# EAGLE design kw36_shield (EAGLE 9.5.1)
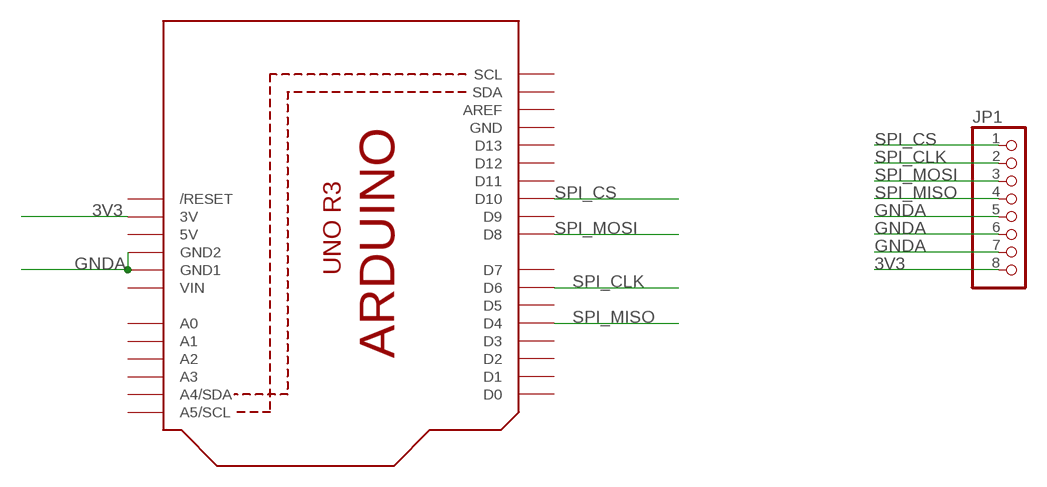
[diagram p0: schematic, sheet 1]

## Parts
JP1  PINHD-1X8  [1X08]
Q1  ARDUINOR3-NOIOREF-NOTEXT  [ARDUINOR3-NOTEXT-NOIOREF]

## Nets
3V3: JP1.8 Q1.3V
GNDA: JP1.5 JP1.6 JP1.7 Q1.GND1 Q1.GND2
SPI_CLK: JP1.2 Q1.D6
SPI_CS: JP1.1 Q1.D10
SPI_MISO: JP1.4 Q1.D4
SPI_MOSI: JP1.3 Q1.D8
Unconnected: Q1.A0 Q1.A1 Q1.A2 Q1.A3 Q1.A4(A4/SDA) Q1.A5(A5/SCL) Q1.AREF Q1.D0 Q1.D1 Q1.D2 Q1.D3 Q1.D5 Q1.D7 Q1.D9 Q1.D11 Q1.D12 Q1.D13 Q1.RESET(/RESET) Q1.SCL Q1.SDA

## Power pins joined to a net without a drawn wire
5V: Q1.5V
GND: Q1.GND
VIN: Q1.VIN

## Library data of the parts
JP1 = pinhead:PINHD-1X8: PIN HEADER
Q1 = adafruit:ARDUINOR3-NOIOREF

## Board
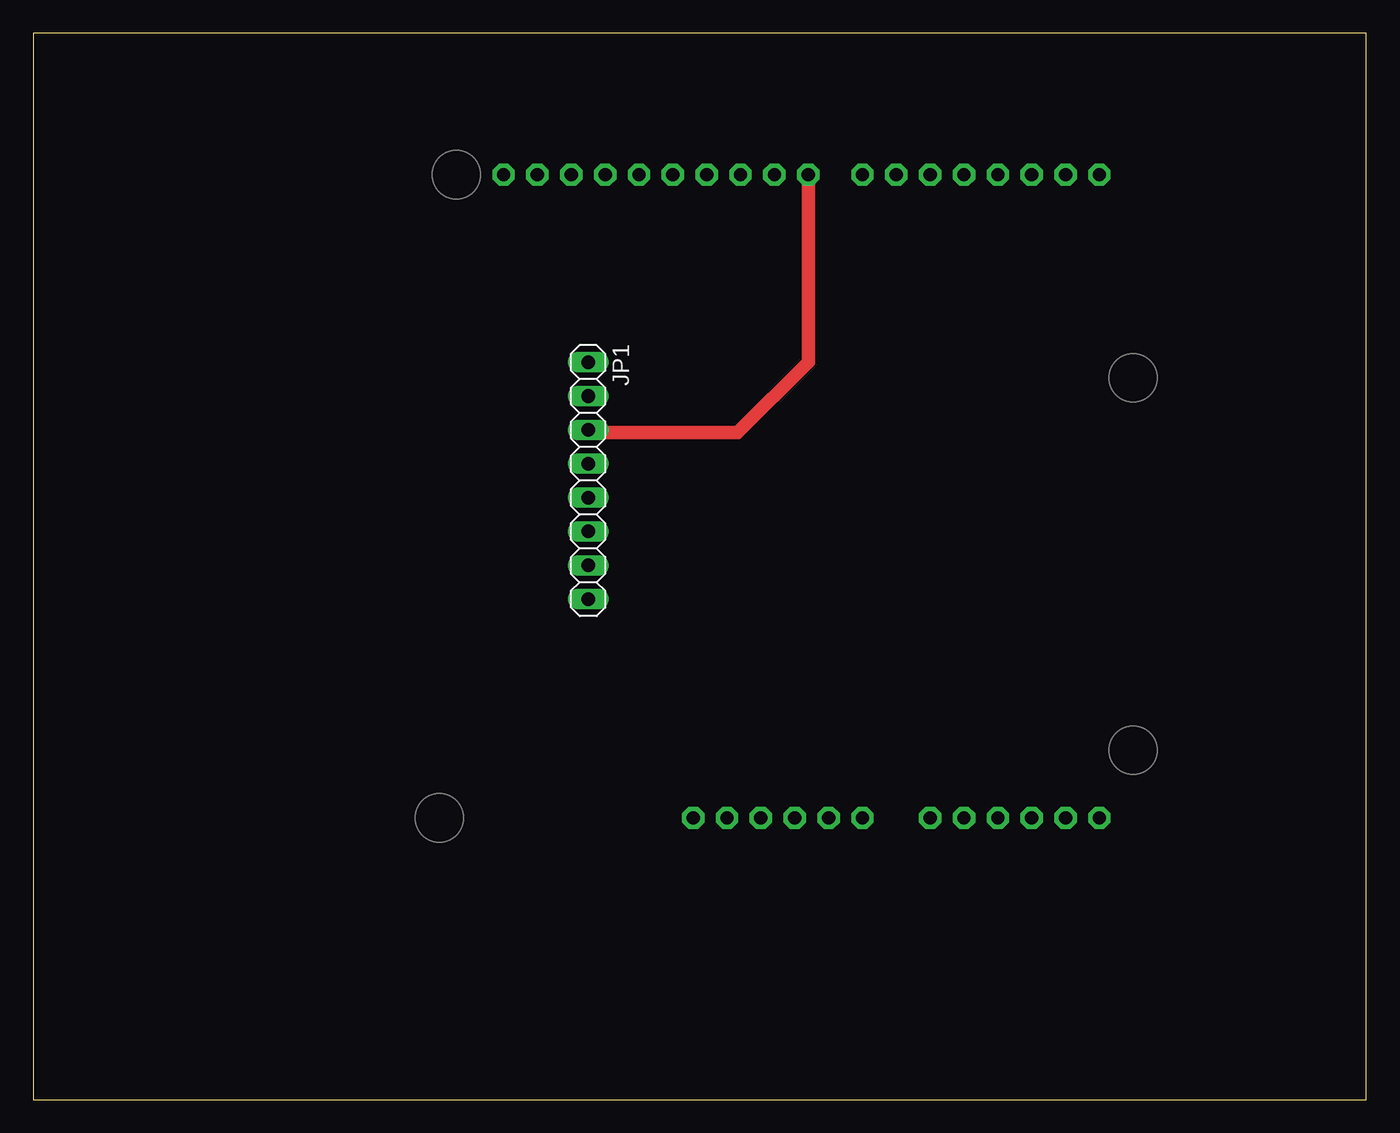
[diagram p1: board, top side]
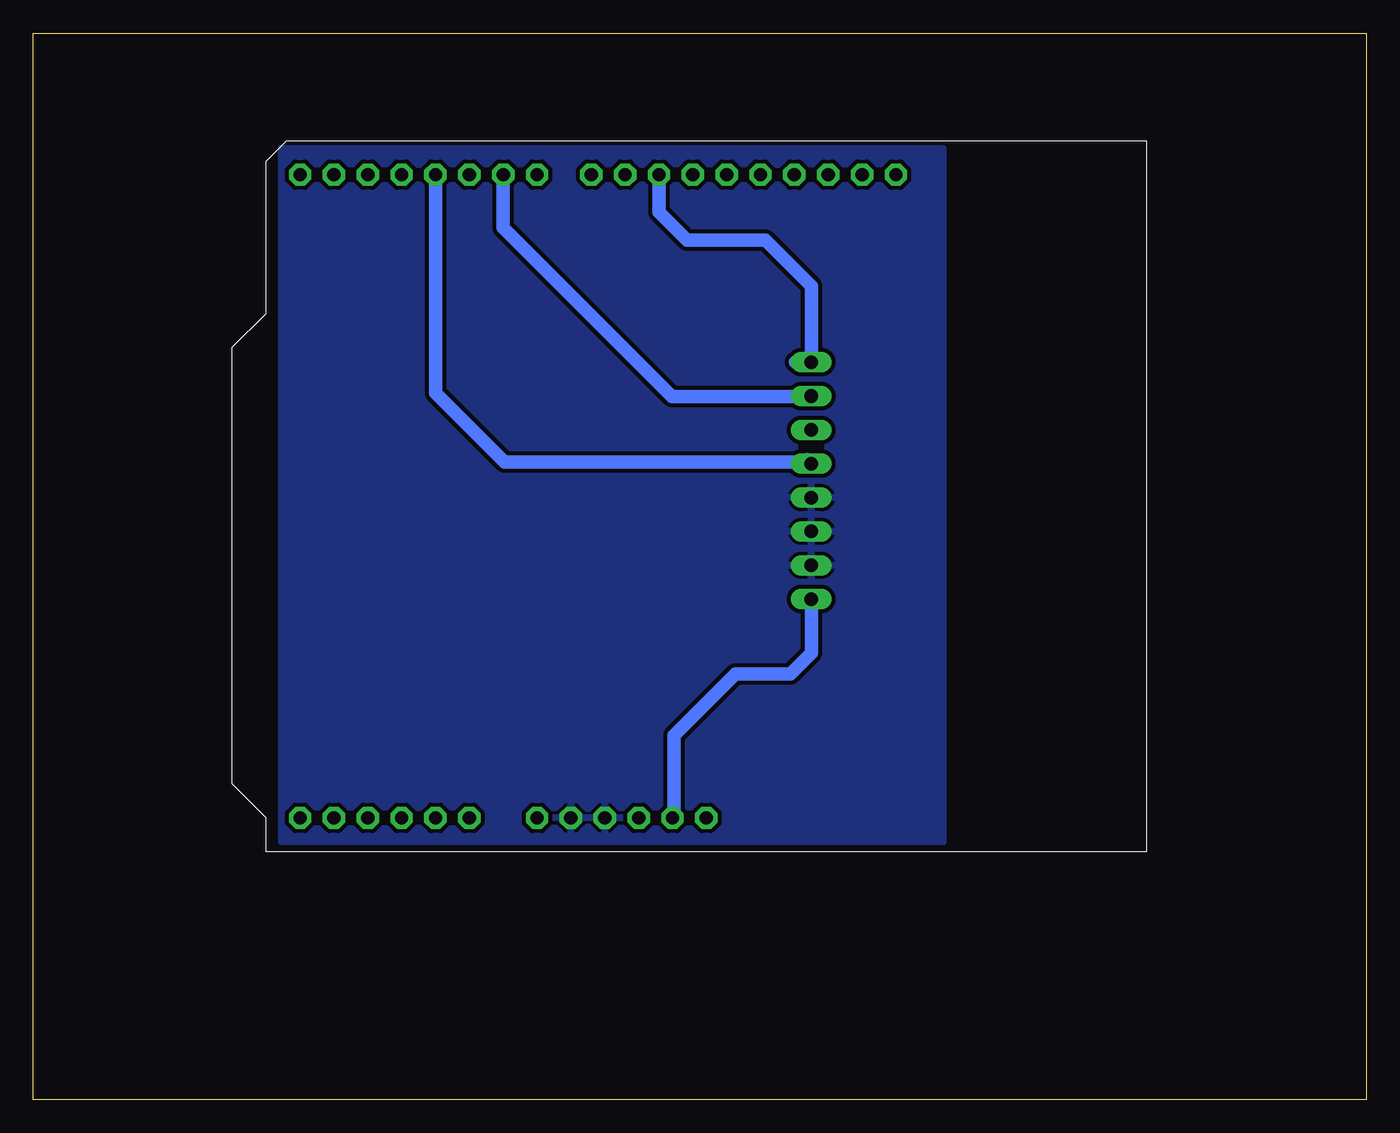
[diagram p2: board, bottom side, seen from below]

Size 100 x 80 mm. Coordinates in mm from the lower left corner, seen from the top.
Outline: 0,0 100,0 100,80 0,80 0,0
Copper layers (1*16): Top 0.035mm / dielectric 1.5mm / Bottom 0.035mm
Design rules "default": minimum track width 6mil, minimum drill 0.35mm, track to track 6mil, track to pad 6mil, pad to pad 6mil, via to via 6mil, smd to smd 6mil, copper to edge 40mil, drill to drill 6mil, minimum pad ring 10mil, minimum via ring 8mil, stop-mask expansion 4mil, vias tented up to drill 0mil, thermal gap 10mil

### Footprints (pad centres in the part's own frame; a part is rotated, then mirrored left to right if it is on the bottom)
1X08 = drill 1.016 long: 1 -8.89,0; 2 -6.35,0; 3 -3.81,0; 4 -1.27,0; 5 1.27,0; 6 3.81,0; 7 6.35,0; 8 8.89,0
ARDUINOR3-NOTEXT-NOIOREF = drill 1 pad 1.676 octagon: 3V 35.56,2.54; 5V 38.1,2.54; A0 50.8,2.54; A1 53.34,2.54; A2 55.88,2.54; A3 58.42,2.54; A4 60.96,2.54; A5 63.5,2.54; AREF 23.876,50.8; D0 63.5,50.8; D1 60.96,50.8; D2 58.42,50.8; D3 55.88,50.8; D4 53.34,50.8; D5 50.8,50.8; D6 48.26,50.8; D7 45.72,50.8; D8 41.656,50.8; D9 39.116,50.8; D10 36.576,50.8; D11 34.036,50.8; D12 31.496,50.8; D13 28.956,50.8; GND 26.416,50.8; GND1 43.18,2.54; GND2 40.64,2.54; RESET 33.02,2.54; SCL 18.796,50.8; SDA 21.336,50.8; VIN 45.72,2.54

### Placement (x,y rotation side)
JP1  41.63,46.43 270 top
Q1  16.48,18.59 0 top

### Tracks (layer width: path | path; a pad name or v marks a point on that pad's centre or on a via)
3V3
  Bottom 1.016: Q1.3V 51.94,21.23 51.94,27.3 47.32,31.93 43.2,31.93 41.63,33.5 JP1.8
GNDA
  pour Bottom (isolate 0.305): 31.75,71.37 31.75,19.33 81.38,19.33 81.38,71.37
SPI_CLK
  Bottom 1.016: JP1.2 41.66,52.76 52.07,52.76 64.75,65.43 Q1.D6
SPI_CS
  Bottom 1.016: 42.82,55.32 JP1.1 41.63,61.04 45.09,64.49 50.95,64.49 53.06,66.6 Q1.D10
SPI_MISO
  Bottom 1.016: 41.76,47.83 41.96,48.03 | 70.03,69.14 69.8,69.37 Q1.D4 69.83,53.01 64.64,47.83 41.76,47.83 | 41.76,47.83 JP1.4
SPI_MOSI
  Top 1.016: Q1.D8 58.14,55.35 52.83,50.04 41.83,50.04 JP1.3